# Altium schematic sheet 1 040 1573.rev01_uart.SchDoc
size A4; SheetNumber: 4; SheetTotal: 5
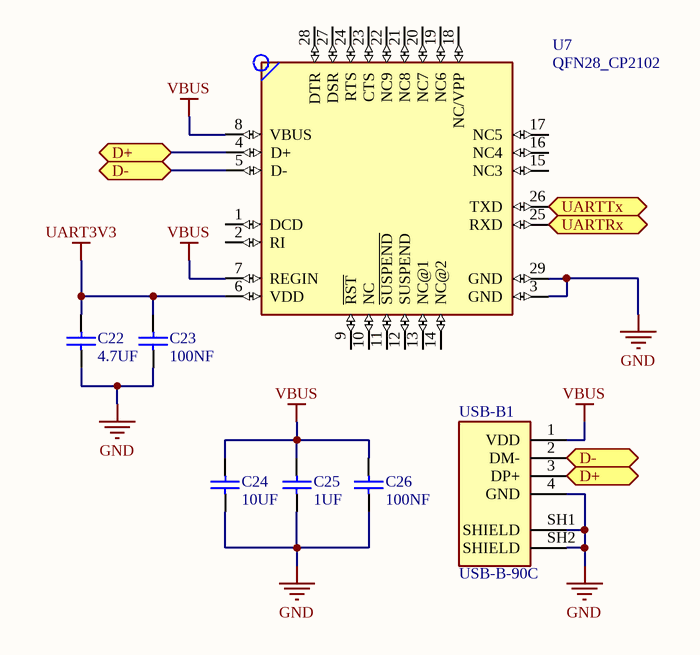
[diagram p0: 1 040 1573.rev01_uart.SchDoc]

## Parts
C22  4.7UF  [Capacitor(0805)-1]
C23  100NF  [Capacitor(0603)-1]
C24  10UF  [Capacitor(0805)-1]
C25  1UF  [Capacitor(0603)-1]
C26  100NF  [Capacitor(0603)-1]
U7  QFN28_CP2102  [QFN28G_0.5-5X5MM]
USB-B1  USB-B-90C  [USB-B-90C]

## Ports
D+ (bidir, see 1 040 1573.rev01_uart[2B]), D+ (bidir, see 1 040 1573.rev01_uart[3C]), D- (bidir, see 1 040 1573.rev01_uart[2B]), D- (bidir, see 1 040 1573.rev01_uart[3C]), UARTRx (bidir, see 1 040 1573.rev01[3B]), UARTTx (bidir, see 1 040 1573.rev01[3B])

## Nets
GND: C22.1 C23.1 C24.1 C25.2 C26.1 U7.3(GND) U7.29(GND) USB-B1.4(GND) USB-B1.SH1(SHIELD) USB-B1.SH2(SHIELD)
UART3V3: C22.2 C23.2 U7.6(VDD)
VBUS: C24.2 C25.1 C26.2 U7.7(REGIN) U7.8(VBUS) USB-B1.1(VDD)
D+: U7.4(D+) USB-B1.3(DP+) ; port D+
D-: U7.5(D-) USB-B1.2(DM-) ; port D-
UARTRx: U7.25(RXD) ; port UARTRx
UARTTx: U7.26(TXD) ; port UARTTx

Not connected (* = marked no-connect by the designer): U7 1(DCD) 2(RI) 9(~{RST}) 10(NC) 11(~{SUSPEND}) 12(SUSPEND) 13(NC@1) 14(NC@2) 15(NC3) 16(NC4) 17(NC5) 18(NC/VPP) 19(NC6) 20(NC7) 21(NC8) 22(NC9) 23(CTS) 24(RTS) 27(DSR) 28(DTR)

## Library data of the parts
C22 = CAP_CER_SMD_4.7UF_35V_0805: 1 043 0232; Published: 8-Jun-2000; LatestRevisionDate: 17-Jul-2002; LatestRevisionNote: Re-released for DXP Platform.; PackageReference: RAD-0.3; Publisher: Altium Limited; Stok Kodu: 1 043 0232
C23 C26 = CAP_CER_SMD_100NF_50V_0603_AEC: 1 043 0098; Published: 8-Jun-2000; LatestRevisionDate: 17-Jul-2002; LatestRevisionNote: Re-released for DXP Platform.; PackageReference: RAD-0.3; Publisher: Altium Limited; Stok Kodu: 1 043 0098
C24 = CAP_CER_SMD_10UF_25V_0805: 1 043 0227; Published: 8-Jun-2000; LatestRevisionDate: 17-Jul-2002; LatestRevisionNote: Re-released for DXP Platform.; PackageReference: RAD-0.3; Publisher: Altium Limited; Stok Kodu: 1 043 0227
C25 = CAP_CER_SMD_1UF_50V_0603_AEC: 1 043 0030; Published: 8-Jun-2000; LatestRevisionDate: 17-Jul-2002; LatestRevisionNote: Re-released for DXP Platform.; PackageReference: RAD-0.3; Publisher: Altium Limited; Stok Kodu: 1 043 0030
U7 = QFN28_CP2102: USB Bridge, USB to UART USB 2.0 UART Interface 28-QFN (5x5); MP: CP2102-GMR; MF: Silicon; Price: None; Availability: In Stock; Package: VFQFN-28 Vishay Siliconix; SnapEDA_Link: https://www.snapeda.com/parts/CP2102-GMR/Silicon+Labs/view-part/?ref=snap; Check_prices: https://www.snapeda.com/parts/CP2102-GMR/Silicon+Labs/view-part/?ref=eda; Value: *; Purchase-URL: https://pricing.snapeda.com/search/part/CP2102-GMR/?ref=eda